# EAGLE design Adafruit QT Py ESP32-C3 (EAGLE 9.6.2)
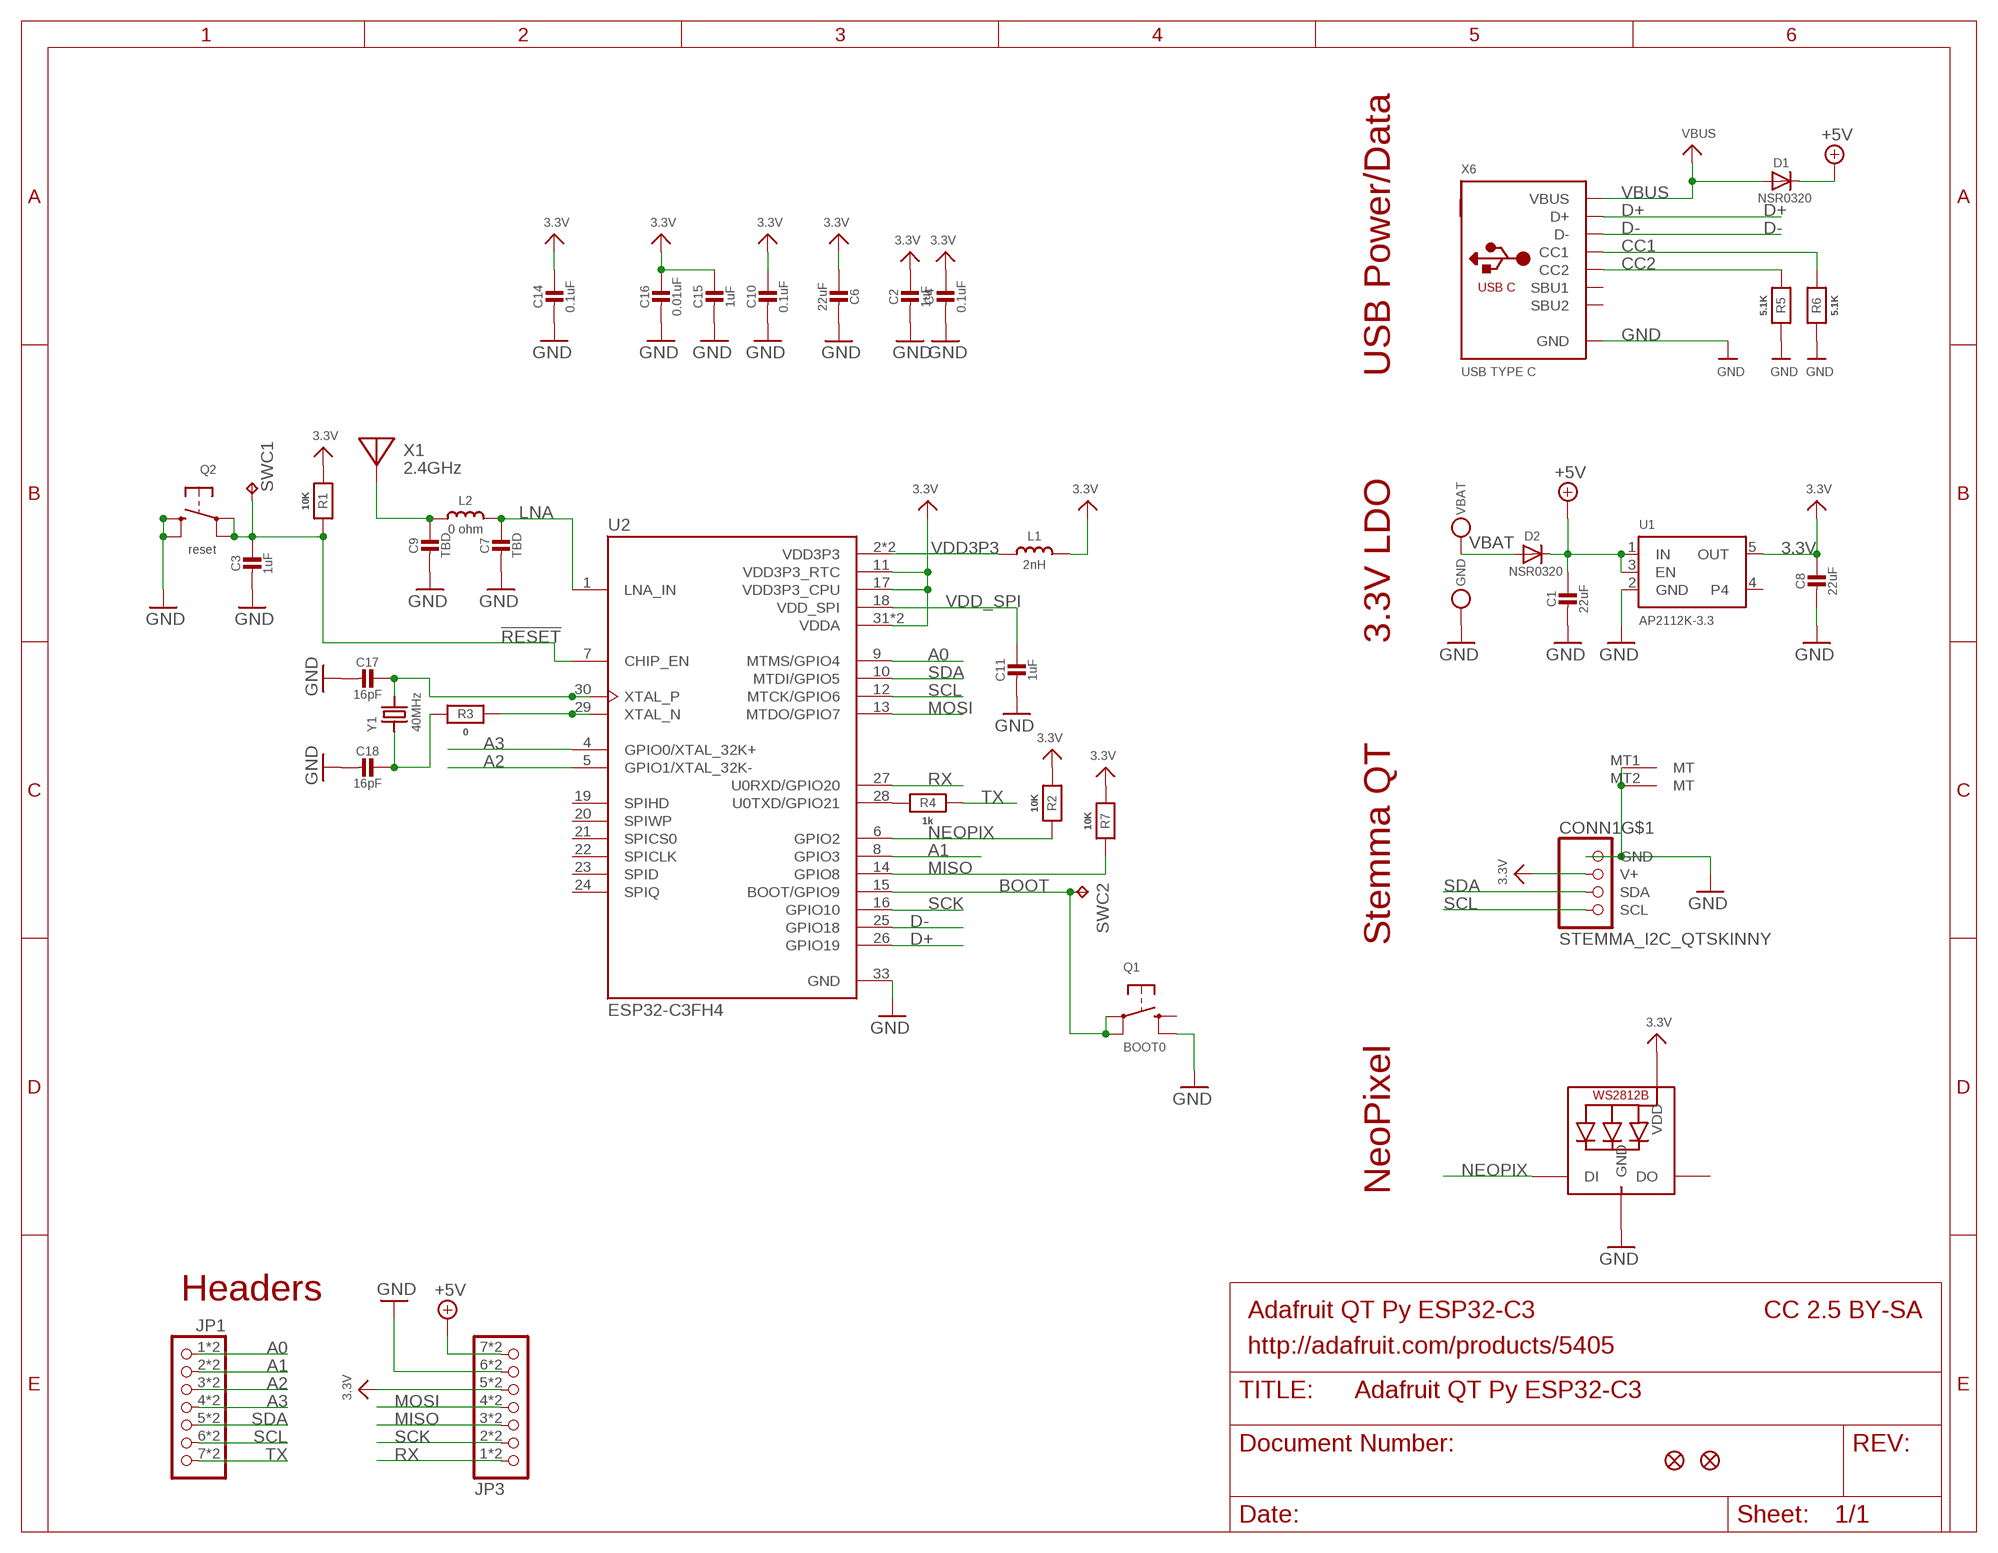
[diagram p0: schematic, sheet 1]

## Parts
C1  22uF  CAP_CERAMIC0805-NOOUTLINE  [0805-NO]
C2  1uF  CAP_CERAMIC_0402NO  [_0402NO]
C3  1uF  CAP_CERAMIC_0402NO  [_0402NO]
C4  0.1uF  CAP_CERAMIC_0402NO  [_0402NO]
C6  22uF  CAP_CERAMIC0805-NOOUTLINE  [0805-NO]
C7  TBD  CAP_CERAMIC_0402NO  [_0402NO]
C8  22uF  CAP_CERAMIC0805-NOOUTLINE  [0805-NO]
C9  TBD  CAP_CERAMIC_0402NO  [_0402NO]
C10  0.1uF  CAP_CERAMIC_0402NO  [_0402NO]
C11  1uF  CAP_CERAMIC_0402NO  [_0402NO]
C14  0.1uF  CAP_CERAMIC_0402NO  [_0402NO]
C15  1uF  CAP_CERAMIC_0402NO  [_0402NO]
C16  0.01uF  CAP_CERAMIC_0402NO  [_0402NO]
C17  16pF  CAP_CERAMIC_0402NO  [_0402NO]
C18  16pF  CAP_CERAMIC_0402NO  [_0402NO]
CONN1  STEMMA_I2C_QTSKINNY  [JST_SH4_SKINNY]
D1  NSR0320  DIODE_SOD323MINI  [SOD-323_MINI]
D2  NSR0320  DIODE_SOD323MINI  [SOD-323_MINI]
GND  TESTPOINT_MINUS  [TESTPOINT_MINUS_1X3MM]
JP1  HEADER-1X7_CASTEL  [1X07_CASTEL]
JP3  HEADER-1X7_CASTEL  [1X07_CASTEL]
L1  2nH  INDUCTOR_0402  [_0402]
L2  0 ohm  INDUCTOR_0402  [_0402]
LED1  WS2812B_SK6805_1515  [SK6805_1515]
Q1  BOOT0  SWITCH_TACT_SMT4.6X2.8  [BTN_KMR2_4.6X2.8]
Q2  reset  SWITCH_TACT_SMT_KMR2SLIM  [BTN_KMR2_SLIM]
R1  10K  RESISTOR_0402NO  [_0402NO]
R2  10K  RESISTOR_0402NO  [_0402NO]
R3  0  RESISTOR_0402NO  [_0402NO]
R4  1k  RESISTOR_0402NO  [_0402NO]
R5  5.1K  RESISTOR_0402NO  [_0402NO]
R6  5.1K  RESISTOR_0402NO  [_0402NO]
R7  10K  RESISTOR_TWO6MIL  [_0603MP_TWO6MIL]
SWC1  TPB1,27  [B1,27]
SWC2  TPB1,27  [B1,27]
U1  AP2112K-3.3  VREG_SOT23-5  [SOT23-5]
U2  ESP32-C3FH4  [QFN32_5MM]
U$6  FIDUCIAL_1MM  [FIDUCIAL_1MM]
U$8  FIDUCIAL_1MM  [FIDUCIAL_1MM]
VBAT  TESTPOINT_PLUS13  [TESTPOINT_PLUS_1X3MM]
X1  2.4GHz  ANTENNA_JOHANSON_2450AT18B100  [ANT_2450AT18B100]
X6  USB TYPE C  USB_C  [USB_C_CUSB31-CFM2AX-01-X]
Y1  40MHz  CRYSTAL_2X1.6MM  [CRYSTAL_2X1.6]

## Nets
3.3V [power]: C2.1 C4.1 C6.1 C8.1 C10.1 C14.1 C15.1 C16.1 CONN1.2(V+) JP3.5 JP3.5C L1.1 LED1.2(VDD) R1.1 R2.1 R7.1 U1.5(OUT) U2.11(VDD3P3_RTC) U2.17(VDD3P3_CPU) U2.31(VDDA) U2.32(VDDA)
!RESET: C3.1 Q2.A'(P1) Q2.A(P) R1.2 SWC1.TP U2.7(CHIP_EN)
+5V [power]: C1.1 D1.C D2.C JP3.7 JP3.7C U1.1(IN) U1.3(EN)
A0: JP1.1 JP1.1C U2.9(MTMS/GPIO4)
A1: JP1.2 JP1.2C U2.8(GPIO3)
A2: JP1.3 JP1.3C U2.5(GPIO1/XTAL_32K-)
A3: JP1.4 JP1.4C U2.4(GPIO0/XTAL_32K+)
BOOT: Q1.A'(P1) Q1.A(P) SWC2.TP U2.15(BOOT/GPIO9)
CC1: R6.2 X6.A5(CC1)
CC2: R5.2 X6.B5(CC2)
D+: U2.26(GPIO19) X6.A6(D+) X6.B6(D+)
D-: U2.25(GPIO18) X6.A7(D-) X6.B7(D-)
GND [power]: C1.2 C2.2 C3.2 C4.2 C6.2 C7.2 C8.2 C9.2 C10.2 C11.2 C14.2 C15.2 C16.2 C17.2 C18.2 CONN1.1(GND) CONN1.MT1(MT) CONN1.MT2(MT) GND.P$1 JP3.6 JP3.6C LED1.4(GND) Q1.B'(S1) Q2.B'(S1) Q2.B(S) R5.1 R6.1 U1.2(GND) U2.33(GND) X6.A1B12(GND) X6.B1A12(GND)
LNA: C7.1 L2.2 U2.1(LNA_IN)
MISO: JP3.3 JP3.3C R7.2 U2.14(GPIO8)
MOSI: JP3.4 JP3.4C U2.13(MTDO/GPIO7)
N$1: R4.1 U2.28(U0TXD/GPIO21)
N$3: C9.1 L2.1 X1.FP
N$5: R3.2 U2.29(XTAL_N)
N$6: C17.1 U2.30(XTAL_P) Y1.3
N$7: C18.1 R3.1 Y1.1
NEOPIX: LED1.1(DI) R2.2 U2.6(GPIO2)
RX: JP3.1 JP3.1C U2.27(U0RXD/GPIO20)
SCK: JP3.2 JP3.2C U2.16(GPIO10)
SCL: CONN1.4(SCL) JP1.6 JP1.6C U2.12(MTCK/GPIO6)
SDA: CONN1.3(SDA) JP1.5 JP1.5C U2.10(MTDI/GPIO5)
TX: JP1.7 JP1.7C R4.2
VBAT: D2.A VBAT.P$1
VBUS [power]: D1.A X6.A4B9(VBUS) X6.B4A9(VBUS)
VDD3P3: L1.2 U2.2(VDD3P3) U2.3(VDD3P3)
VDD_SPI [power]: C11.1 U2.18(VDD_SPI)
Unconnected: LED1.3(DO) Q1.B(S) U1.4 U2.19(SPIHD) U2.20(SPIWP) U2.21(SPICS0) U2.22(SPICLK) U2.23(SPID) U2.24(SPIQ) X6.A8(SBU1) X6.B8(SBU2)

## Notes on the sheet
- USB Power/Data
- 3.3V LDO
- Stemma QT
- NeoPixel
- Headers
- Adafruit QT Py ESP32-C3 | CC 2.5 BY-SA
- http://adafruit.com/products/5405

## Library data of the parts
C1-C4 C6-C11 C14-C18 = microbuilder:CAP_CERAMIC: Ceramic Capacitors For new designs, use the packages preceded by an '_' character since they are more reliable: The following footprints should be used on most boards: _0402 - Standard footprint for regular board layouts _0603 - Standard footprint for regular board layouts _0805 - Standard footprint for regular board layouts _1206 - Standard footprint for regular board layouts For extremely tight-pitch boards where space is at a premium, the following 'micro-pitch' footprints can be used (smaller pads, no silkscreen outline, etc.): _0402MP - Micro-pitch footprint for very dense/compact boards _0603MP - Micro-pitch footprint for very dense/compact boards _0805MP - Micro-pitch footprint for very dense/compact boards _1206MP - Micro-pitch footprint for very dense/compact boards
CONN1 = microbuilder:STEMMA_I2C
D1 D2 = microbuilder:DIODE: Diode SMA Model Volts Amps Type Vf Ir Digikey # Notes SSA34-E3 40V 3A Schottky 480mV @ 3A 200uA @ 40V SSA34-E3/61TGITR-ND CDBA120-G 20V 1A Schottky 500mV @ 1A 500uA @ 20V 641-1014-6-ND REEL MBRA210 10V 2A Schottky 350mV @ 2A 700uA @ 10V MBRA210LT3 SOD-123 Model Volts Amps Type Vf Ir Order # Notes BAT54T1G 30V 200mA Schottky 800mV @ 200mA 2uA @ 25V BAT54T1GOSTR-ND B0530W 30V 500mA Schottky 430mV @ 500mA 130uA @ 30V B0530W-FDICT-ND REEL MBR120 20V 1A Schottky 340mV @ 1A MBR120VLSFT1GOSCT-ND SOD-323 Model Volts Amps Type Vf Ir Order # Notes PMEG2005EJ 20V 500mA Schottky 355mV @ 500mA 568-4110-1-ND ZLLS410 10V 570mA Schottky 380mV @ 570mA ZLLS410CT-ND 1N4148WS 75V 150mA Silicon/Simple 1V 1N4148WSFSCT-ND REEL SOD-523 Model Volts Amps Type Vf Ir Order # Notes BAT54XV2 30V 200mA Schottky 0.8V @ 100mA BAT54XV2CT-ND TB751S 30V 30mA Schottky RB751S-40TE61CT-ND SOT23-R/W (R = Solder Paste/Reflow Ovens, W = Hand-Soldering) Model Volts Amps Type Vf Ir Order # Notes BAT54FILM 40V 300mA Schottky 497-7162-1-ND POWERDI-5 Model Volts Amps Type Vf Ir Order # Notes PDS560 60V 5A Schottky 670mV @ 5A 150uA @ 60V PDS560DICT-ND
GND VBAT = microbuilder:TESTPOINT: Test Point Various test points for characterisation and PCB testing TESTPOINT_SMT - Compact Surface Mount Test Point [Digikey: 5016KTR-ND]
JP1 JP3 = microbuilder:HEADER-1X7: PIN HEADER
L1 L2 = microbuilder:INDUCTOR: Inductors 0603: 10nH Ceramic Inductor - microwire antenna/RF (Digikey: 712-1434-2-ND) 0805: 560nH Ceramic Inductor - RF (Digikey: 553-1047-1-ND) 270nH Ceramic Inductor - Q = 40@250MHz, +-5%, 1 Ohm DC Resistance (Digikey: 535-10506-2-ND) 1007 (2518 Metric) SMT: 10µH 10% 250mOhm 820mA 1007 Inductor (Digikey: 587-2189-1-ND) 22µH 10% 500mOhm 580mA 1007 Inductor (Digikey: 587-2190-1-ND) 47µH 10% 950mOhm 420mA 1007 Inductor (Digikey: 587-2191-1-ND) 47µH 5% 100mOhm 1A 1008 Inductor (Digikey: 732-1816-1-ND) 5.0x5.0mm (Taiyo Yuden NR5040 Series) 6.8µH 20% 2.3A 64mOhm Inductor (Digikey: 587-2374-2-ND) 5.0x5.0mm (TDK VLC5045 Series) 4.7µH 20% 3.3A 34mOhm Inductor (Digikey: 445-6526-1-ND) 6.8µH 20% 2.7A 46mOhm Inductor (Digikey: 445-6527-1-ND) 6.0x6.0mm (TDK VLC6045 Series) 4.7µH 20% 3.8A 27mOhm Inductor (Digikey: 445-6538-2-ND) 6.8µH 20% 3A 41mOhm Inductor (Digikey: 445-6540-1-ND) 6.2µH 30% 2.2A 45mOhm Inductor (Digikey: SRR5028-6R2YCT-ND) - Not TDK VLC6045 but footprint should match 6.0x6.0mm (TDK SLF6045 Series) 6.8uH 30% 2A 33mOhm Inductor (Digikey: 445-4572-1-ND, Mouser: 810-SLF645T6R8N2R0PF) 6.0x6.0mm (Sumida CDRH5D28 Series) 6.2uH 30% 1.8A 45mOhm Inductor (Digikey: 308-1542-1-ND) Taiyo Yuden NR3015T2R2M - 2.2uH 20% 1.5A (Digikey: 587-1648-2-ND, Mouser: 963-NR3015T2R2M) - Used with TI TPS62172 CoilCraft RFID Transponder Coil - MA5532-AE (For use with AS3935 Lightning Sensor) Taiyo Yuden NRH2412T2R2MNGH - 2.2uH 20% 1AA (Digikey: 587-3443-1-ND) - Used with TI LM3671 Vishay IHLP 1.0uH Molded Inductor - 24mOhm DCR, 5A, +/-20%, -55°C-125°C (Digikey: 541-1319-1-ND)
LED1 = microbuilder:WS2812B
Q1 Q2 = adafruit_electromech:SWITCH_TACT_SMT: SMT Tact Switches 6x6mm - Digikey: P12940SCT-ND KMR2 (4.6x2.8mm) - Digikey: 401-1426-1-ND EVQ-PQHB55 - Light Touch, 160GF (4.5x4.5mm) - Digikey: P8090SCT-ND KMT0 - KMT021 NGJ LHS (etc.) IP68/Waterproof - Digikey: CKN10289CT-ND
R1-R7 = microbuilder:RESISTOR: Resistors For new designs, use the packages preceded by an '_' character since they are more reliable: The following footprints should be used on most boards: _0402 - Standard footprint for regular board layouts _0603 - Standard footprint for regular board layouts _0805 - Standard footprint for regular board layouts _1206 - Standard footprint for regular board layouts For extremely tight-pitch boards where space is at a premium, the following 'micro-pitch' footprints can be used (smaller pads, no silkscreen outline, etc.): _0402MP - Micro-pitch footprint for very dense/compact boards _0603MP - Micro-pitch footprint for very dense/compact boards _0805MP - Micro-pitch footprint for very dense/compact boards _1206MP - Micro-pitch footprint for very dense/compact boards
SWC1 SWC2 = testpad:TP: Test pad
U1 = adafruit_power:VREG_SOT23-5: SOT23-5 Fixed Voltage Regulators Part Current Out V Out V In V Dropout θJA (°C/W) TJ (°C) Digikey Part No. ADP121 150mA 3.3V 3.4-5.5V 0.09V @ 150mA -- -- ADP121-AUJZ33R7CT-ND ADP121 150mA 3.0V 3.1-5.5V 0.09V @ 150mA -- -- ADP121-AUJZ30R7CT-ND ADP122 300mA 3.3V 3.4-5.5V 0.085V @ 300mA -- -- ADP122AUJZ-3.3-R7CT-ND ADP1712 300mA 3.3V 3.5-5.5V 0.17V @ 300mA -- -- ADP1712AUJZ-3.3-R7TR-ND AP7311 (Low Cost) 150mA 3.3V 3.5-6V 0.15V @ 150mA -- -- AP7311-33WG-7DICT-ND LD39015M18R 150mA 1.8V 1.9V-5.5V 0.08V @ 100mA -- -- 497-6977-1-ND LP2985A-33DBVR 150mA 3.3V 3.3-16V 0.28V @ 150mA 206 150 296-18479-1-ND MCP1824T-3302E/OT 300mA 3.3V 3.5V-6V 0.2V @ 300mA -- -- MCP1824T-3302E/OTCT-ND MIC5205-2.5YM5 TR 150mA 2.5V 2.7-16V 0.165V @ 150mA -- -- 576-1257-2-ND MIC5205-3.0YM5 TR 150mA 3.0V 3.2V-16V 0.165V @ 150mA -- -- 576-1258-2-ND MIC5205-3.3YM5 TR 150mA 3.3V 3.5V-16V 0.165V @ 150mA -- -- 576-1259-2-ND TPS780330220 150mA 3.3V+2.2V 3.6-5.5V 250mV Max -- -- 296-23332-1-ND TDA3663/N1,135 100mA 3.3V 3.5-45V 0.18V @ 50mA -- -- 568-5343-1-ND Max operating temp can be calculated using θJA, TJ (max junction temperature), and power in watts. Set the "Maximum Ambient Temperature" until it reaches TJ ("Max Junction Temperature"), which is the absolute limit for safe use of the regulator: Heat Sink Temperature Calculator <http://www.daycounter.com/Calculators/Heat-Sink-Temperature-Calculator.phtml> For example, With 12V source into a 3.3V LP2985 and a 30mA load, we are dissipating (12V-3.3V) * 0.03A = 0.261W. With a θJA of 206 °C/W, a TJ of 150°C, and 261mW we can safely use the chip without a heat sink up to 75°C (=147.1°C Junction Temperature).
U2 = adafruit_wireless:ESP32-C3FH4; DESCRIPTION: Bluetooth, WiFi 802.11b/g/n, Bluetooth v5.0 Transceiver Module 2.402GHz ~ 2.48GHz Antenna Not Included Surface Mount; DIGI-KEY_PART_NUMBER: 1904-ESP32-C3FH4CT-ND; MF: Espressif Systems; MP: ESP32-C3FH4; PACKAGE: VFQFN-32 Espressif Systems; PURCHASE-URL: https://pricing.snapeda.com/search/part/ESP32-C3FH4/?ref=eda
U$6 U$8 = microbuilder:FIDUCIAL: Fiducial Alignment Points Various fiducial points for machine vision alignment.; BOM: EXCLUDE
X1 = adafruit_wireless:ANTENNA_JOHANSON_2450AT18B100: Johanson 2.4GHz Chip Antenna (1206 Package) Frequency Range: 2400 - 2500 Mhz Peak Gain 0.5 dBi typ. (XZ-V) Average Gain -0.5 dBi typ. (XZ-V) Input Power 3W max. Operating Temperature -40 to +85°C Digikey: 712-1006-1-ND
X6 = adafruit_electromech:USB_C: USB Type-C USB 2.0 Connector
Y1 = microbuilder:CRYSTAL: Crystals HC49UP - Surface Mount Crystal 4.0MHz 18pF +/-30ppm Surface Mount Crystal [Digikey: 535-9857-1-ND] 12.0 MHz Surface Mount Crystal [Digikey: 535-9869-6-ND] 25.0 MHz Surface Mount Crystal [Digikey: 535-9078-1-ND] 2.5 x 2.0mm - MEMs SMT Crystal 16.0 MHz 10pF 20ppm 2.5 x 2.0mm Crystal [Digikey -40-85°C: 535-10923-1-ND] 3.2 x 2.5mm - MEMs SMT Crystal 12.0 MHz 8pF 15ppm 3.2 x 2.5mm Crystal [Digikey: -10-70°C: 644-1047-1-ND -40-125°C: 644-1128-1-ND] 40~85°C cheaper: 644-1173-6-ND 16.0 MHz 8pF 15ppm 3.2 x 2.5mm Crystal [Digikey: -10-70°C: 644-1049-1-ND -40-125°C: 644-1129-2-ND]-40~85°C cheaper: 644-1175-6-ND 16.0 MHz 10pF 10ppm 3.2 x 2.5mm Crystal [Digikey: 644-1100-1-ND] 27.12 MHz 18pF 30ppm 3.2 x 2.5mm Crystal [Digikey: 887-1424-1-ND] 27.12MHz 10pF 10ppm 3.2 x 2.5mm Crystal [Digikey: 887-1329-1-ND] 4.9 x 1.8mm - MEMs SMT Crystal 32.768 KHz 12.5pF 20ppm 4.9 x 1.8mm Crystal [Digikey: SE2415CT-ND] 8.0 x 3.8mm - Surface Mount Crystal 32.768kHz 12.5pF 20ppm -40°C-85°C [Digikey: 535-9166-2-ND] Cylinder 32.768KHz Cylinder Crystal (2x6mm body) [Ex. Digikey: 300-8341-2-ND]

## Net classes
1 power: width 0.254 mm
2 gnd: width 0.254 mm

## Board
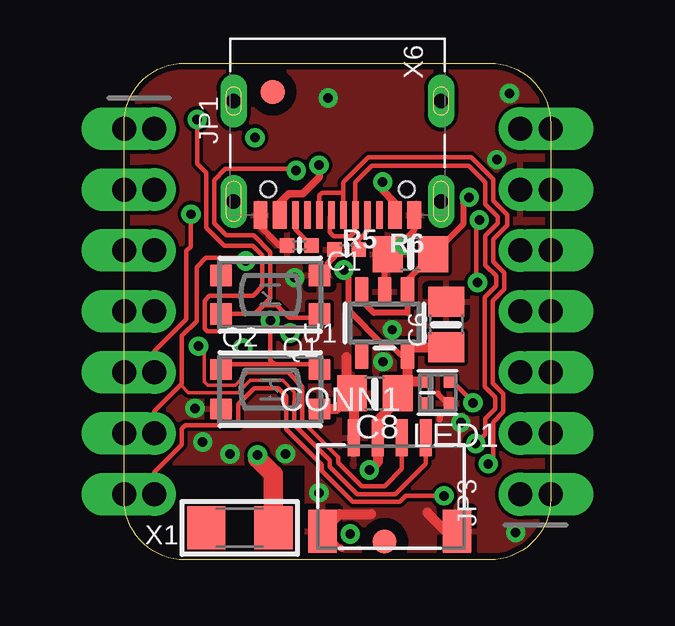
[diagram p1: board, top side]
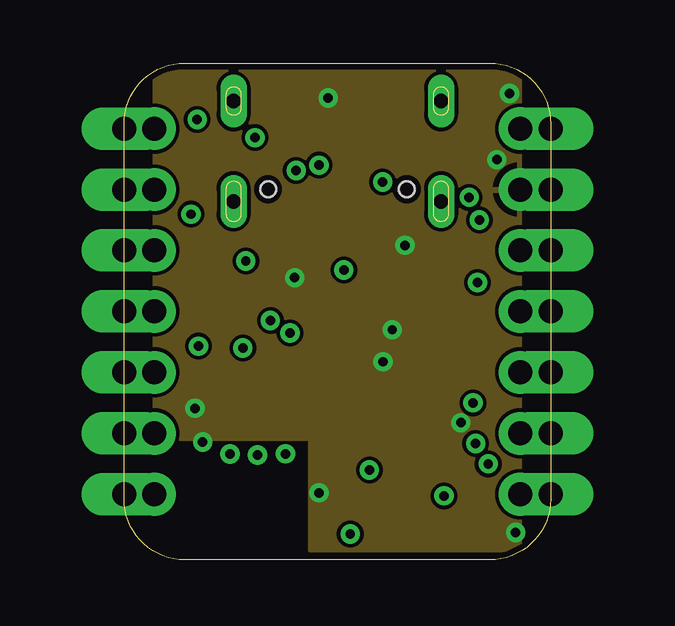
[diagram p2: board, inner layer Route2]
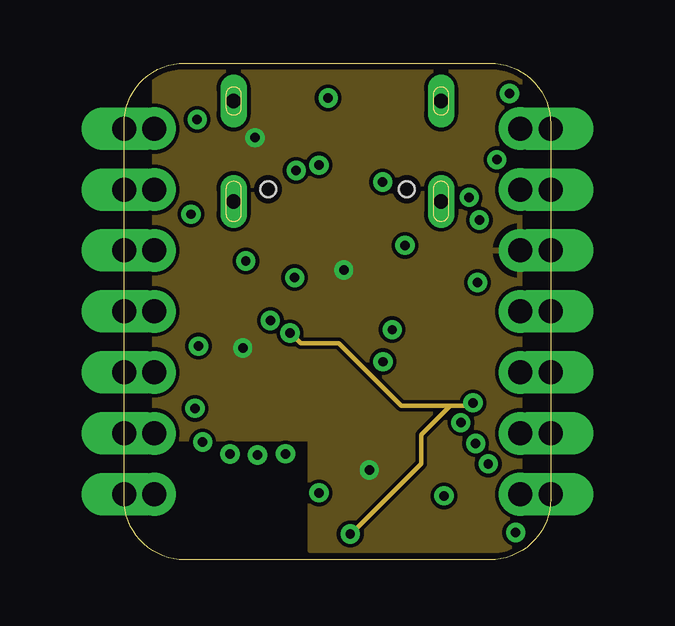
[diagram p3: board, inner layer Route15]
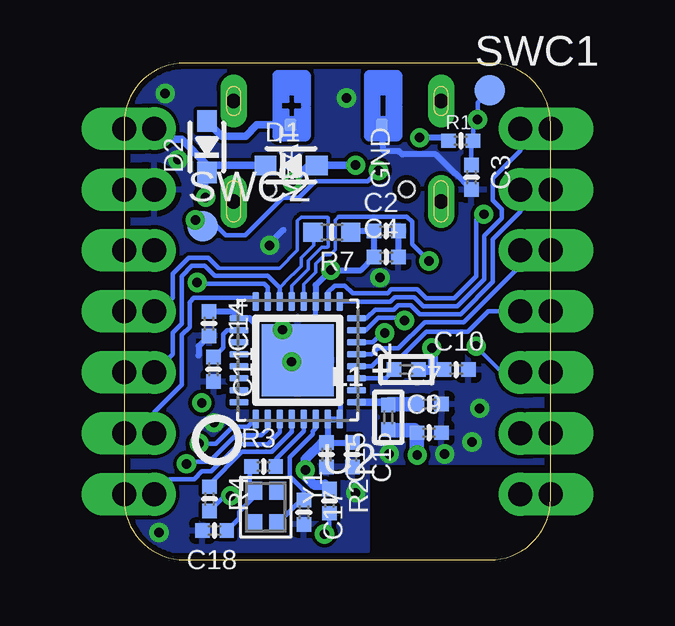
[diagram p4: board, bottom side, seen from below]

Size 17.78 x 20.7 mm. Coordinates in mm from the lower left corner, seen from the top.
Outline: 17.78,18.16 17.78,2.54 arc-90 15.24,0 2.54,0 arc-90 0,2.54 0,18.16 arc-90 2.54,20.7 15.24,20.7 arc-90 17.78,18.16
Copper layers (1*16): Top 0.035mm / dielectric 1.5mm / Bottom 0.035mm
Design rules "adafruit 6-6 *": minimum track width 6mil, minimum drill 15.5mil, track to track 6mil, track to pad 6mil, pad to pad 6mil, via to via 6mil, smd to smd 6mil, copper to edge 10mil, drill to drill 8mil, minimum pad ring 10mil, minimum via ring 8mil, stop-mask expansion 2mil, vias tented up to drill 20mil, thermal gap 10mil

### Footprints (pad centres in the part's own frame; a part is rotated, then mirrored left to right if it is on the bottom)
0805-NO = smd 1.24 x 1.5: 1 -0.95,0; 2 0.95,0
_0402NO = smd 0.6 x 0.6: 1 -0.508,0; 2 0.508,0
JST_SH4_SKINNY = smd 0.5 x 1.55: 1 -1.5,2.514; 2 -0.5,2.514; 3 0.5,2.514; 4 1.5,2.514 | smd 1.2 x 1.8: MT1 -2.8,-1.386; MT2 2.8,-1.386
SOD-323_MINI = smd 0.9 x 0.8: A 1.07,0; C -1.07,0
TESTPOINT_MINUS_1X3MM = smd 0.5 x 0.5: P$1 0.8,-0.05
1X07_CASTEL = drill 1 pad 1.778: 1 -7.62,0; 2 -5.08,0; 3 -2.54,0; 4 0,0; 5 2.54,0; 6 5.08,0; 7 7.62,0 | drill 1 pad 1.778 long: 1C -7.62,-1.27; 2C -5.08,-1.27; 3C -2.54,-1.27; 4C 0,-1.27; 5C 2.54,-1.27; 6C 5.08,-1.27; 7C 7.62,-1.27
_0402 = smd 0.6 x 0.6: 1 -0.508,0; 2 0.508,0
SK6805_1515 = smd 0.5 x 0.5: 1 -0.5,-0.45; 2 0.5,-0.45; 3 0.5,0.45; 4 -0.5,0.45
BTN_KMR2_4.6X2.8 = smd 0.9 x 0.9: A 2.05,0.8; A' -2.05,0.8; B 2.05,-0.8; B' -2.05,-0.8
BTN_KMR2_SLIM = smd 0.9 x 0.85: A 2.05,0.825; A' -2.05,0.825; B 2.05,-0.825; B' -2.05,-0.825
_0603MP_TWO6MIL = smd 0.8 x 0.8: 1 -0.787,0; 2 0.787,0
B1,27 = smd 1.27 x 1.27: TP 0,0
SOT23-5 = smd 0.55 x 1.2: 1 -0.95,-1.3; 2 0,-1.3; 3 0.95,-1.3; 4 0.95,1.3; 5 -0.95,1.3
QFN32_5MM = smd 0.81 x 0.27: 1 -2.45,1.75; 2 -2.45,1.25; 3 -2.45,0.75; 4 -2.45,0.25; 5 -2.45,-0.25; 6 -2.45,-0.75; 7 -2.45,-1.25; 8 -2.45,-1.75; 17 2.45,-1.75; 18 2.45,-1.25; 19 2.45,-0.75; 20 2.45,-0.25; 21 2.45,0.25; 22 2.45,0.75; 23 2.45,1.25; 24 2.45,1.75 | smd 0.27 x 0.81: 9 -1.75,-2.45; 10 -1.25,-2.45; 11 -0.75,-2.45; 12 -0.25,-2.45; 13 0.25,-2.45; 14 0.75,-2.45; 15 1.25,-2.45; 16 1.75,-2.45; 25 1.75,2.45; 26 1.25,2.45; 27 0.75,2.45; 28 0.25,2.45; 29 -0.25,2.45; 30 -0.75,2.45; 31 -1.25,2.45; 32 -1.75,2.45 | smd 3 x 3: 33 0,0
FIDUCIAL_1MM = smd 1 x 1: 1 0,0
TESTPOINT_PLUS_1X3MM = smd 0.5 x 0.5: P$1 0.8,-0.05
ANT_2450AT18B100 = smd 1.6 x 1.8: FP -1.4,0; NC 1.4,0
USB_C_CUSB31-CFM2AX-01-X = smd 0.575 x 1.15: A1B12 -3.2,3.545; A4B9 -2.4,3.545; B1A12 3.2,3.545; B4A9 2.4,3.545 | smd 0.275 x 1.15: A5 -1.25,3.545; A6 -0.25,3.545; A7 0.25,3.545; A8 1.25,3.545; B5 1.75,3.545; B6 0.75,3.545; B7 -0.75,3.545; B8 -1.75,3.545 | drill 0.6 pad 1 long: M1 -4.32,2.97; M2 4.32,2.97; M3 -4.32,-1.21; M4 4.32,-1.21 | hole 0.65: 2.89,2.47; -2.89,2.47
CRYSTAL_2X1.6 = smd 0.75 x 0.7: 1 -0.675,-0.5; 2 0.675,-0.5; 3 0.675,0.5; 4 -0.675,0.5

### Placement (x,y rotation side)
C1  11.94,12.74 180 top
C2  6.86,13.7 0 bottom
C3  3.3,15.94 270 bottom
C4  6.86,12.62 0 bottom
C6  13.42,9.8 90 top
C7  5.05,6.49 0 bottom
C8  10.45,6.93 180 top
C9  5.07,5.3 0 bottom
C10  3.94,7.92 0 bottom
C11  14.05,7.94 270 bottom
C14  14.24,9.84 270 bottom
C15  9.35,4.38 270 bottom
C16  8.27,4.38 270 bottom
C17  10.29,1.98 270 bottom
C18  14.01,1.22 180 bottom
CONN1  11.07,2.58 0 top
D1  10.82,16.43 0 bottom
D2  14.33,17.21 90 bottom
GND  6.99,18.92 270 bottom
JP1  1.27,10.35 270 top
JP3  16.51,10.35 90 top
L1  6.02,7.92 180 bottom
L2  6.77,5.94 90 bottom
LED1  13.07,6.97 180 top
Q1  6.1,11.05 180 top
Q2  6.1,7.11 0 top
R1  3.75,17.46 0 bottom
R2  9.22,2.45 270 bottom
R3  11.96,3.89 0 bottom
R4  14.22,2.54 270 bottom
R5  7.3,13.11 0 top
R6  9.27,12.93 0 top
R7  9.12,13.65 180 bottom
SWC1  2.54,19.56 0 bottom
SWC2  14.5,13.91 0 bottom
U1  10.86,9.87 180 top
U2  10.54,8.32 180 bottom
U$3  [QTPYC3_TOP]  0,0 0 top
U$6  6.2,19.49 0 top
U$8  10.86,0.76 0 top
U$12  [PCBFEAT-REV-040]  13.91,4.99 0 bottom
U$18  [QTPYC3_BOT]  17.78,0 0 bottom
VBAT  10.79,18.92 270 bottom
X1  4.83,1.33 180 top
X6  8.89,17.91 180 top
Y1  11.87,2.2 270 bottom

### Tracks (layer width: path | path; a pad name or v marks a point on that pad's centre or on a via)
3.3V  (via drill 0.39)
  Top 0.203: 10.81,8.93 11.12,8.93 11.49,8.57
  Top 0.254: 11.49,8.57 U1.5 12.1,8.85 | v9.16,12.08 9.34,11.9 9.34,10.41 10.81,8.93 | C8.1 11.81,7.34 11.89,7.42
  Top 0.406: 12.1,8.85 C6.1 | U1.5 11.81,7.34 | 11.4,6.66 10.57,5.83 CONN1.2 10.57,4.1 v10.22,3.75 | LED1.2 11.89,7.42
  Top 0.61: 11.4,6.66 C8.1
  Bottom 0.203: U2.17 12.96,10.1 | U2.11 9.79,10.21 9.91,10.1 8.89,10.1 8.76,9.97 8.76,6.54 | U2.32 8.76,5.9 8.76,6.54 | 12.32,9.84 12.32,6.67 12.19,6.54 8.76,6.54
  Bottom 0.254: U2.11 9.79,11.45 v9.16,12.08 7.91,12.08 C4.1 C2.1 8.28,13.7 R7.1 | C15.1 C16.1 | C15.1 9.29,4.89 U2.31 U2.32 | C14.1 13.27,10.35 U2.17 12.55,10.07 12.32,9.84 | JP3.5C JP3.5 16.51,13.02 | C15.1 9.53,4.89 | R1.1 4.38,17.59 v5.46,17.59 | 10.22,3.49 v10.22,3.75
  Bottom 0.406: v10.22,3.75 10.22,4.19 9.53,4.89 | L1.1 4.89,7.92 | 4.89,7.92 C10.1 | 4.89,7.92 4.89,8.76 v4.95,8.83 | 10.22,3.49 9.87,3.14 9.4,3.14 R2.1
  pour Route15: 1.27,5.02 7.75,5.02 7.75,0.38 16.51,0.38 16.51,20.7 1.27,20.7
!RESET  (via drill 0.39)
  Top 0.178: 6.27,8.14 4.06,8.14 Q2.A' | Q2.A 8.08,8.14 6.27,8.14 | 6.27,8.14 6.1,8.31 v6.1,9.97 5.65,9.53 3.46,9.53 3.35,9.63 3.35,10.8 3.56,11 5.38,11 5.77,11.39 5.77,12.69 5.36,13.1 4.17,13.1 3.43,13.84 3.43,16.13 3.05,16.51 v3.05,18.35
  Bottom 0.178: U2.7 7.71,9.57 7.18,10.1 6.22,10.1 v6.1,9.97 | SWC1.TP 3.05,19.05 v3.05,18.35 3.24,18.16 R1.2 3.3,17.4 C3.1
+5V  (via drill 0.39)
  Top 0.254: U1.3 10.03,11.04 10.03,10.67 10.41,10.29 11.81,10.29 U1.1 11.81,11.66 C1.1 14.13,13.98 14.13,14.88 14.36,15.11 v14.38,15.11
  Bottom 0.254: D2.C 14.33,16.47 | D2.C 14.03,16.43 | v14.38,15.11 14.42,15.14 | 14.42,16.05 D2.C
  Bottom 0.305: JP3.7C JP3.7 16.07,17.53 15.38,17.53 14.33,16.47 | 14.03,16.43 D1.C | 14.42,15.14 14.42,16.05
A0
  Bottom 0.178: JP1.1 1.27,17.78 1.27,17.05 2.41,15.9 2.41,14.97 2.04,14.6 2.04,14.24 2.77,13.51 2.77,11.69 3.89,10.57 5.32,10.57 5.69,10.94 6.5,10.94 6.68,10.76 7.99,10.76 8,10.77 U2.9
  Bottom 0.254: JP1.1C 1.08,17.97 1.27,17.78
A1
  Bottom 0.178: JP1.2 1.27,14.51 2.41,13.36 2.41,11.81 2.41,11.58 3.76,10.24 5.46,10.24 5.83,10.61 6.36,10.61 6.55,10.43 7.32,10.43 7.68,10.07 U2.8
  Bottom 0.254: JP1.2C JP1.2
A2
  Bottom 0.178: U2.5 7.46,8.57 7.21,8.81 6.34,8.81 5.25,9.91 3.62,9.91 1.27,12.26 JP1.3
  Bottom 0.254: JP1.3C JP1.3
A3
  Bottom 0.178: U2.4 7.46,8.07 7.04,8.48 6.21,8.48 5.19,9.5 3.45,9.5 2.6,10.35 JP1.4
  Bottom 0.254: JP1.4C JP1.4
BOOT  (via drill 0.39)
  Top 0.178: Q1.A' 8.06,10.25 7.91,10.1 6.88,10.1 6.36,10.61 5.83,10.61 5.47,10.25 Q1.A 5.44,10.25 6.1,10.9 6.1,12.83 5.4,13.53 4.25,13.53 3.76,14.02 3.76,15.82 4.22,16.29 7.11,16.29 v7.18,16.23 | v14.8,14.16 14.67,14.02 14.67,11.62 v14.73,11.56
  Bottom 0.178: U2.15 11.79,11.36 11.94,11.51 14.68,11.51 v14.73,11.56 | v7.18,16.23 7.63,15.77 9.82,15.77 10.49,15.1 11.16,15.1 12.73,13.53 13.54,13.53 13.92,13.91 SWC2.TP 14.55,13.91 v14.8,14.16
CC1
  Top 0.178: X6.A5 10.14,13.7 9.78,13.34 R6.2
CC2
  Top 0.178: X6.B5 7.14,13.78 R5.2
D+  (via drill 0.39)
  Top 0.178: 9.14,15.3 9.14,15.73 10.19,16.78 14.46,16.78 15.38,15.86 15.38,14.96 15.96,14.38 15.96,13.94 15.38,13.36 15.38,12.42 15.84,11.96 15.84,11.28 15.37,10.81 15.37,7.36 15.81,6.92 15.81,6.17 15.38,5.74 15.38,4 v15.18,4 | 9.14,15.3 X6.A6 | 9.14,15.3 8.26,15.3 8.14,15.19 X6.B6
  Bottom 0.178: U2.26 11.79,5.45 12.06,5.18 13.12,5.18 14.22,4.08 15.1,4.08 v15.18,4
D-  (via drill 0.39)
  Top 0.178: X6.A7 8.57,14.29 8.57,13.65 8.74,13.48 9.42,13.48 9.64,13.7 X6.B7 9.64,15.73 10.33,16.42 14.35,16.42 15.05,15.73 15.05,14.83 15.57,14.3 15.57,14.02 15.05,13.49 15.05,12.29 15.51,11.83 15.51,11.41 15.04,10.94 15.04,7.22 15.48,6.78 15.48,6.3 15.05,5.88 15.05,5.24 v14.65,4.84
  Bottom 0.178: U2.25 12.62,5.54 13.26,5.54 13.95,4.84 v14.65,4.84
GND  (via drill 0.39)
  Top 0.254: X6.B1A12 5.69,13.88 6.46,13.11 R5.1 | X6.A1B12 12.09,13.74 11.09,12.74 | 11.09,12.74 C1.2 | R6.1 8.76,12.64 8.48,12.36 8.48,12.18 Q1.B' | 13.08,6.92 13.48,6.52 LED1.4 13.57,6.4 13.16,6 13.16,5.86 13.14,5.84 | CONN1.MT1 8.96,0.51 9.04,0.51 9.09,0.46 | U1.2 10.86,12.51 11.09,12.74
  Top 0.406: Q2.B 8.86,6.29 C8.2 | CONN1.MT2 13.41,1.19 12.64,1.97 | C8.2 9.27,7.17 9.27,8.45 | C8.2 9.57,6.86 CONN1.1 | CONN1.MT1 8.99,1.91 10.28,1.91
  Bottom 0.254: JP3.6C JP3.6 | C14.2 14.67,8.9 14.67,8.51 | C3.2 4,16.13 4.03,16.13 4.79,16.89 6.18,16.89 6.32,17.03 6.88,17.03 6.9,17.02 6.92,17.02 6.99,17.08 GND.P$1 | C2.2 C4.2 | v11.71,13.11 11.71,13.18 11.14,13.75
  other vias: 8.13,2.79 7.11,11.76 10.79,8.26 8.51,19.24 16.07,19.43 2.96,6.31 3.28,4.91 6.73,4.42 11.18,9.59 14.03,5.71 16.32,1.14 15.53,16.68 4.42,4.41
  pour Top: 0,4.03 7.62,4.03 7.62,0.38 17.78,0.38 17.78,20.7 0,20.7
  pour Bottom: 0,4.04 7.62,4.04 7.62,0.38 17.78,0.38 17.78,20.7 0,20.7
  pour Route2: 1.27,20.7 16.51,20.7 16.51,0.38 7.75,0.38 7.75,5.02 1.27,5.02
LNA
  Bottom 0.178: L2.2 6.89,6.57
  Bottom 0.305: U2.1 6.89,6.57
  Bottom 0.61: L2.2 6.74,6.48 5.58,6.48 C7.1
MISO
  Bottom 0.152: 11.29,11.33 11.1,11.52 11.1,11.55 10.4,12.24 10.4,12.59 9.88,13.11 R7.2
  Bottom 0.178: JP3.3C JP3.3 15.75,8.57 15.75,9.46 15.38,9.83 15.38,11.83 14.95,12.26 14.41,12.26 13.99,11.84 11.8,11.84 11.29,11.33 U2.14
MOSI
  Bottom 0.152: U2.13 10.79,11.42 10.09,12.12 10.09,12.46 9.53,13.02 9.31,13.02 9.28,13.06 9.28,14.25 9.31,14.28 10.4,14.28 10.55,14.13 10.55,12.89 11.29,12.15 13.85,12.15 13.86,12.17
  Bottom 0.178: 16.51,10.41 JP3.4 | JP3.4C 16.57,10.35 16.51,10.41 | 16.51,10.41 16.26,10.41 15.75,10.92 15.75,11.92 15.09,12.59 14.28,12.59 13.86,12.17
N$1
  Bottom 0.178: U2.28 10.79,5.33 11.62,4.5 12.87,4.5 14.22,3.14 R4.1
N$3  (via drill 0.39)
  Top 0.406: v5.56,4.37 5.56,4.22
  Top 0.813: 5.56,4.22 6.23,3.56 X1.FP
  Bottom 0.406: 5.58,4.38 v5.56,4.37
  Bottom 0.61: L2.1 6.73,5.4 5.68,5.4 C9.1 5.58,4.38
N$5
  Bottom 0.178: U2.29 10.29,5.36 11.43,4.22 11.43,3.91 R3.2
N$6
  Bottom 0.178: U2.30 9.79,5.49 9.92,5.36 9.92,5.23 10.87,4.28 10.87,3.48 10.29,2.9 C17.1 10.41,2.49 Y1.3
N$7
  Bottom 0.178: R3.1 12.54,3.82 12.54,3.03 Y1.1 12.37,2.62 12.98,2.01 12.98,1.74 C18.1
NEOPIX  (via drill 0.39)
  Top 0.178: v14.54,6.54 14.54,6.58 13.7,7.42 LED1.1
  Route15 0.178: v6.92,9.46 7.35,9.02 8.95,9.02 11.56,6.41 13.59,6.41 | v14.54,6.54 14.41,6.41 13.59,6.41 | v9.43,1.08 9.46,1.08 12.38,4 12.38,5.21 13.59,6.41
  Bottom 0.178: U2.6 7.42,9.07 6.92,9.57 v6.92,9.46 | R2.2 9.22,1.29 v9.43,1.08
RX
  Bottom 0.178: U2.27 11.29,5.32 11.78,4.83 13,4.83 14.14,3.68 14.54,3.68 14.86,3.36 15.88,3.36 JP3.1
  Bottom 0.254: JP3.1C JP3.1
SCK
  Bottom 0.178: JP3.2C JP3.2 16.51,6.16 15.37,7.3 15.37,9.38 15.05,9.7 15.05,10.73 14.87,10.92 12.44,10.92 U2.16
SCL  (via drill 0.39)
  Top 0.152: 2.37,7.29 2.68,6.97 4.76,6.97 5.27,7.48 6.6,7.48 7.1,6.99 7.1,6.59
  Top 0.178: v5.07,12.46 4.95,12.58 3.4,12.58 3.02,12.2 3.02,9.94 2.41,9.34 2.41,7.34 2.37,7.29 1.27,6.19 JP1.6 | CONN1.4 12.57,4.01 11.3,2.74 9.72,2.74 8.57,3.88 8.57,4.16 7.1,5.64 7.1,6.59
  Bottom 0.152: U2.12 10.29,11.49 9.79,11.99 9.79,12.34 9.41,12.72 9.18,12.72 8.97,12.93 8.97,14.15 8.82,14.3
  Bottom 0.178: v5.07,12.46 5.77,13.15 5.77,14.08 5.99,14.3 8.82,14.3
  Bottom 0.254: JP1.6C JP1.6
SDA  (via drill 0.39)
  Top 0.152: 5.16,7.81 4.63,7.28 3.49,7.28 3.34,7.43 3.34,8.67 v3.11,8.9
  Top 0.165: 8.93,4.27 7.43,5.77
  Top 0.178: JP1.5 1.27,8.7 2.6,10.03 2.6,12.87 2.79,13.05 v2.79,14.4 | CONN1.3 11.57,3.79 10.86,3.07 9.91,3.07 8.93,4.05 8.93,4.27 | 7.43,5.77 7.43,7.22 6.84,7.81 5.16,7.81
  Bottom 0.165: v3.11,8.9 3.11,8.84 3.08,8.86 2.03,7.81 JP1.5
  Bottom 0.178: U2.10 9.29,11.14 9,11.43 8.57,11.43 8.26,11.11 6.79,11.11 6.63,11.27 5.56,11.27 5.18,10.9 4.03,10.9 3.1,11.82 3.1,14.2 2.9,14.4 v2.79,14.4
  Bottom 0.254: JP1.5C JP1.5
TX  (via drill 0.39)
  Top 0.178: v13.34,2.67 11.75,2.67 11.49,2.41 9.54,2.41 8.24,3.7 8.24,3.97 6.77,5.45 6.77,6.81 6.43,7.15 5.44,7.15 4.76,6.48 4.76,5.61 2.56,5.61 2.41,5.46 2.41,4.8 1.27,3.65 JP1.7
  Bottom 0.178: v13.34,2.67 13.59,2.67 R4.2
  Bottom 0.254: JP1.7C JP1.7
VBAT
  Bottom 0.305: D2.A 13.7,17.65 12.71,17.65 12.24,18.12 VBAT.P$1
VBUS  (via drill 0.39)
  Top 0.254: X6.B4A9 6.49,14.87 | X6.A4B9 11.29,14.88
  Top 0.305: 6.49,14.87 6.87,15.25 7.45,15.25 8.13,15.93 v8.13,16.45 | 11.29,14.88 10.78,15.39 v10.78,15.74
  Bottom 0.254: v8.13,16.45 8.14,16.43 | 10.08,16.43 D1.A
  Bottom 0.305: D1.A 8.14,16.43 | v10.78,15.74 10.08,16.43
VDD3P3
  Bottom 0.178: U2.2 U2.3 6.88,7.57 L1.2
VDD_SPI
  Bottom 0.178: U2.18 13.48,9.57 13.65,9.4 13.65,8.84 C11.1